# EasyEDA Pro project ERG-2025-2.eprj

# Schematic Schematic
Board Name: Balança-ERG; Create Date: 2025-11-15; Page Name: P1; Project Name: Amplificador_ERG-2025-2; Schematic Name: Schematic; Update Date: 2025-11-15; Company: EasyEDA.com; Page Size: A4; Version: V1.0
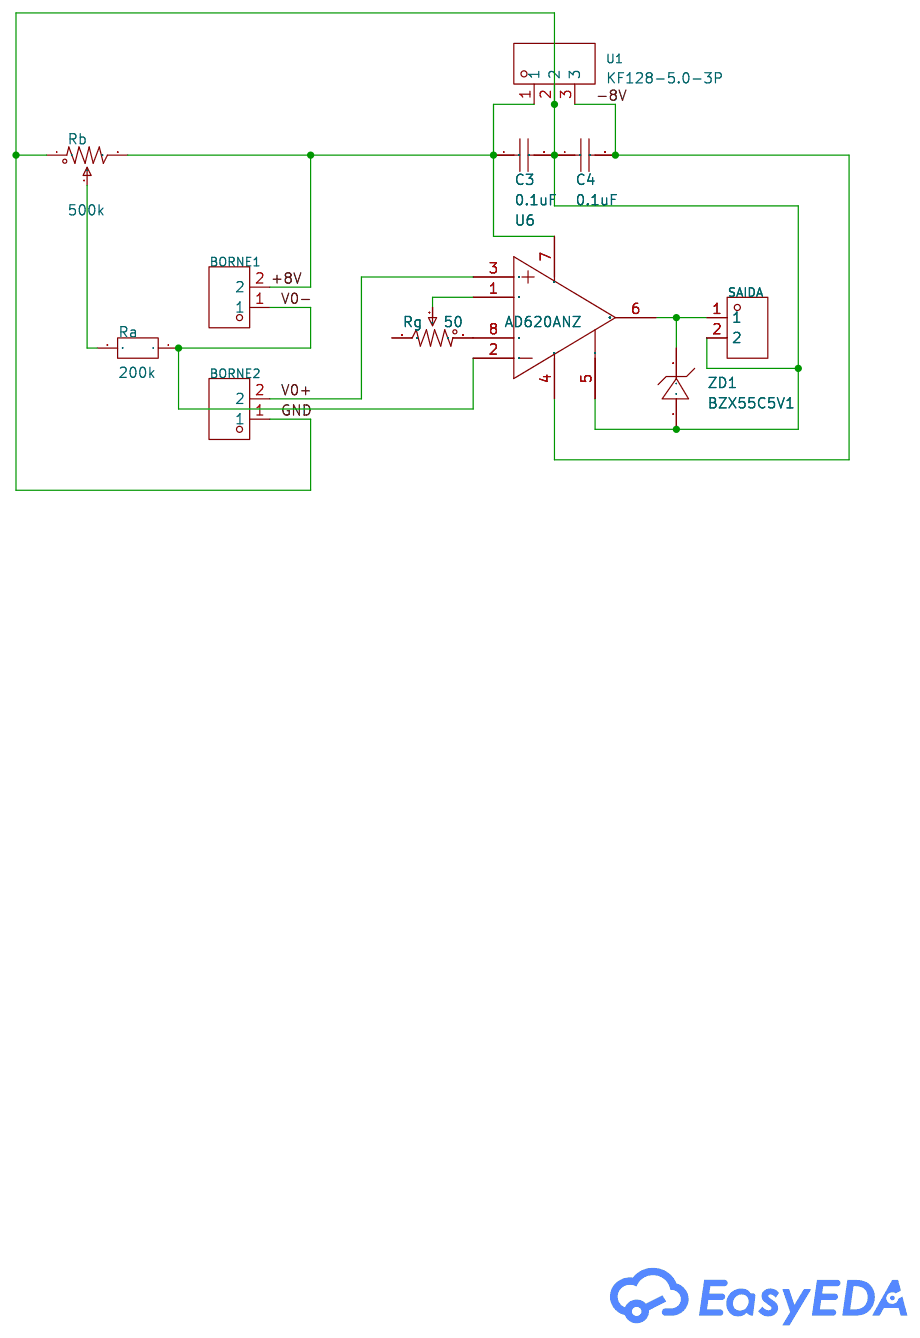
[diagram p0: schematic sheet]

## Parts
BORNE1  KF128L-5.08-2P  [CONN-TH_P5.08_KF128L-5.08-2P]
BORNE2  KF128L-5.08-2P  [CONN-TH_P5.08_KF128L-5.08-2P]
C3  0.1uF  [CAP-TH_L8.5-W5.0-P5.00-D1.2]
C4  0.1uF  [CAP-TH_L8.5-W5.0-P5.00-D1.2]
Ra  200k  [RES-TH_BD2.3-L6.5-P10.50-D0.5]
Rb  500k  [RES-ADJ-TH_3P-L10.0-W10.0-P2.50-L]
Rg  50  [RES-ADJ-TH_3P-L10.0-W10.0-P2.50-L]
SAIDA  KF128L-5.08-2P  [CONN-TH_P5.08_KF128L-5.08-2P]
U1  KF128-5.0-3P  [CONN-TH_3P-P5.00_KF128-5.0-3P]
U6  AD620ANZ  [DIP-8_L9.3-W6.4-P2.54-LS7.6-BL]
ZD1  BZX55C5V1  [DO-35_BD2.0-L4.0-P8.00-D0.5-FD]

## Library data of the parts
BORNE1 BORNE2 SAIDA = KF128L-5.08-2P: Structure:1x2P Pitch:5.08mm Color:Green Mounting Style:Straight Current Rating (Max):24A Voltage Rating (Max):250V Number of Pins:2P Number of Rows:1 Wire Gauge - AWG:12~22 Wire Gauge - AWG:12~22 Wire Gauge - mm2:2.5 Wire Gauge - mm2:2.5 Number of PINs Pe; LCSC Part Name: 5.08mm 1x2P 排数:1 每排P数:2 直插; Supplier Part: C474940; Manufacturer: KEFA(科发); Supplier Footprint: 插件,P=5.08mm; JLCPCB Part Class: Extended Part; Datasheet: https://atta.szlcsc.com/upload/public/pdf/source/20230317/B060EDB51EF5BF4A4FF6377D02780B11.pdf; Supplier: LCSC; Structure: 1x2P; Pitch: 5.08mm; Color: Green; Mounting Style: Straight; Current Rating (Max): 24A; Voltage Rating (Max): 250V; Number of Pins: 2P; Number of Rows: 1; Wire Gauge - AWG: 12~22; Wire Gauge - mm2: 2.5; Number of PINs Per Row: 2; Operating Temperature Range: -40℃~+105℃
C3 C4 = CT4-0805B105K500F3: Capacitance:1uF Tolerance:±10% Tolerance:±10% Voltage Rating:50V Temperature Coefficient:X7R; LCSC Part Name: 1uF ±10% 50V; Supplier Part: C94708; Manufacturer: FH(风华); Supplier Footprint: 插件,P=5.08mm; JLCPCB Part Class: Extended Part; Datasheet: https://atta.szlcsc.com/upload/public/pdf/source/20190402/C385200_059806A6312B28FF1421A2413EB641E1.pdf; Supplier: LCSC; Tolerance: ±10%; Voltage Rating: 50V; Temperature Coefficient: X7R
Ra = MF1/4W-1KΩ±1%T52: Type:Metal Film Resistors Resistance: Tolerance:±1% Tolerance:±1% Power(Watts):250mW Temperature Coefficient:±200ppm/℃ Temperature Coefficient:±200ppm/℃; LCSC Part Name: 金属膜电阻 1kΩ ±1% 250mW; Supplier Part: C713997; Manufacturer: 华星机电; Supplier Footprint: 插件,D2.3xL6.5mm; JLCPCB Part Class: Extended Part; Datasheet: https://atta.szlcsc.com/upload/public/pdf/source/20200731/C713882_AE8EB1102749D7E4FB4FB13DC898C429.pdf; Supplier: LCSC; Type: Metal Film Resistors; Tolerance: ±1%; Power(Watts): 250mW; Temperature Coefficient: ±200ppm/℃
Rb Rg = 3296W-1-103_C118954: Resistance: Tolerance:±10% Tolerance:±10%; LCSC Part Name: 10kΩ ±10%; Supplier Part: C118954; Manufacturer: BOCHEN(博晨); Manufacturer Part: 3296W-1-103; Supplier Footprint: 插件; JLCPCB Part Class: Extended Part; Datasheet: https://atta.szlcsc.com/upload/public/pdf/source/20171114/C118954_15106326646611117443.pdf; Supplier: LCSC; Tolerance: ±10%
U1 = KF128-5.0-3P: Structure:1x3P Pitch:5mm Color:Green Mounting Style:Straight Current Rating (Max):24A Voltage Rating (Max):250V Number of Pins:3P Number of Rows:1 Wire Gauge - AWG:12~22 Wire Gauge - AWG:12~22 Wire Gauge - mm2:2.5 Wire Gauge - mm2:2.5 Number of PINs Per R; LCSC Part Name: 5mm 1x3P 排数:1 每排P数:3 直插; Supplier Part: C474951; Manufacturer: KEFA(科发); Supplier Footprint: 插件,P=5mm; JLCPCB Part Class: Extended Part; Datasheet: https://atta.szlcsc.com/upload/public/pdf/source/20230317/B8CD42C0E3A38C01CD877E6842427715.pdf; Supplier: LCSC; Structure: 1x3P; Pitch: 5mm; Color: Green; Mounting Style: Straight; Current Rating (Max): 24A; Voltage Rating (Max): 250V; Number of Pins: 3P; Number of Rows: 1; Wire Gauge - AWG: 12~22; Wire Gauge - mm2: 2.5; Number of PINs Per Row: 3; Operating Temperature Range: -40℃~+105℃
U6 = AD620ANZ: Number of Channels:Single channel Common Mode Rejection Ratio(CMRR):100dB Ib - Input Bias Current:500pA Vos - Input Offset Voltage:30uV Gain Bandwidth Product:- Slew Rate:0.75V/us Voltage - Supply:2.3V~18V；-18V~-2.3V Voltage - Supply:2.3V~18V；-18V~-2.3V O; LCSC Part Name: 低成本低功耗仪表放大器; Supplier Part: C9680; Manufacturer: ADI(亚德诺); Supplier Footprint: DIP-8; JLCPCB Part Class: Extended Part; Datasheet: https://atta.szlcsc.com/upload/public/pdf/source/20121103/1457706545320.pdf; Supplier: LCSC; Number of Channels: Single channel; Common Mode Rejection Ratio(CMRR): 100dB; Ib - Input Bias Current: 500pA; Vos - Input Offset Voltage: 30uV; Slew Rate: 0.75V/us; Voltage - Supply: 2.3V~18V；-18V~-2.3V; Output Current: 18mA; -3dB Bandwidth: 120kHz; Quiescent Current per Amplifier: 1.3mA; Input Offset Voltage Drift(Vos TC): 0.3uV/℃; Operating Temperature: -40℃~+85℃
ZD1 = BZX55C5V1_C2512: Diode Configuration:Independent Type Zener Voltage(Nom):5.1V Reverse Leakage Current (Ir):100nA@1V Zener Voltage(Range):4.8V~5.4V Zener Voltage(Range):4.8V~5.4V Pd - Power Dissipation:- Impedance(Zzt):35Ω; Supplier Part: C2512; Manufacturer: ST(先科); Supplier Footprint: DO-35; JLCPCB Part Class: Extended Part; Datasheet: https://atta.szlcsc.com/upload/public/pdf/source/20170719/C118630_1500457760295828336.pdf; Supplier: LCSC; Diode Configuration: Independent Type; Zener Voltage(Nom): 5.1V; Reverse Leakage Current (Ir): 100nA@1V; Zener Voltage(Range): 4.8V~5.4V; Impedance(Zzt): 35Ω

## Nets
+8V: BORNE1.2 C3.1 Rb.3 U1.1 U6.7(+VS)
-8V: C4.2 U1.3 U6.4(-VS)
GND: BORNE2.1 C3.2 C4.1 Rb.1 SAIDA.2 U1.2 U6.5(REF) ZD1.1(A)
V0+: BORNE2.2 U6.3(+IN)
V0-: BORNE1.1 Ra.1 U6.2(-IN)
$1N521: Rg.1 U6.8(RG)
$1N525: Rg.2 U6.1(RG)
$1N810: SAIDA.1 U6.6(OUTPUT) ZD1.2(K)
$1N1172: Ra.2 Rb.2

Not connected (* = marked no-connect by the designer): Rg 3

# Board PCB
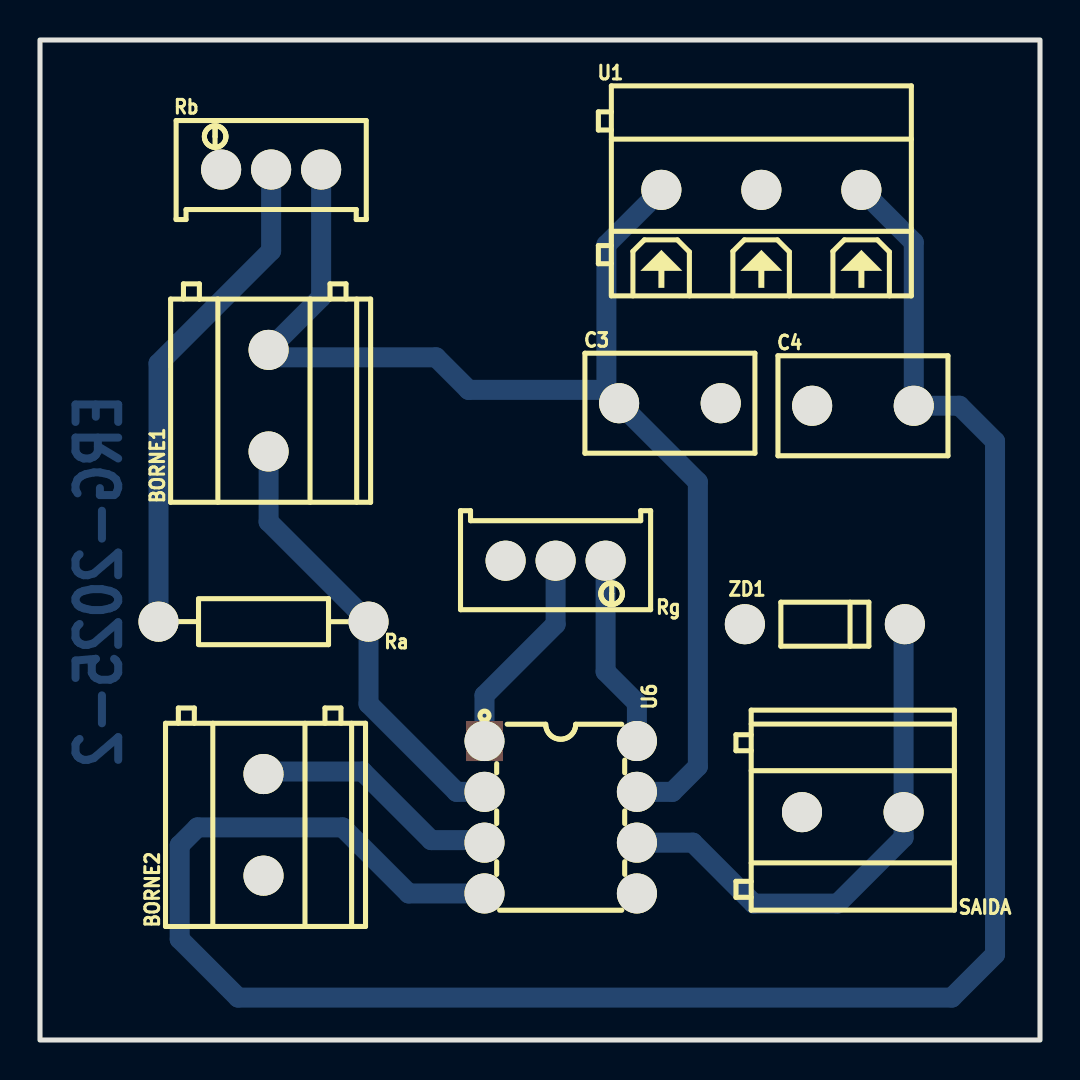
[diagram p1: board, top side]
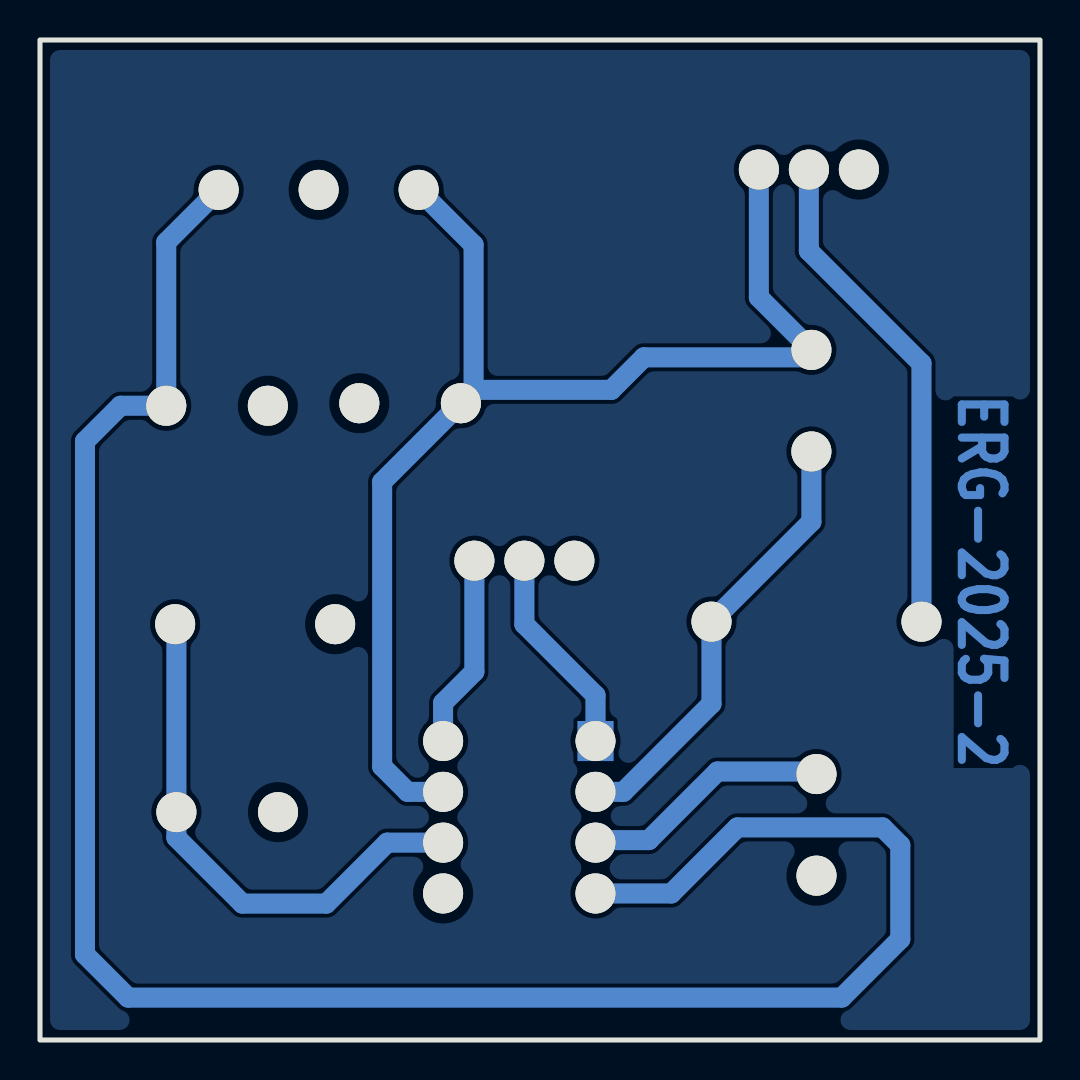
[diagram p2: board, bottom side, seen from below]

Outline 50 x 50 mm; copper layers: Top Layer, Bottom Layer. Coordinates in mm from the lower left corner of the outline.
Outline path: rectangle 0,50 50,0
Stack: Top Layer 0.035mm / Dielectric1 1.51mm FR4 er 4.5 / Bottom Layer 0.035mm

## Design rules (mm)
template: Custom Config
spacing copperThickness1oz (default): track to track 0.102, other pairs 0.152 to 0.3
spacing copperThickness2oz: track to track 0.203, other pairs 0.152 to 0.3
track width copperThickness1oz (default): min 1, default 1, max 1
track width copperThickness2oz: min 0.203, default 0.254, max 2.54
differential pair differentialPair (default): width min 0.127, default 0.254, max 2.54; gap min 0.152, default 0.152
via viaSize (default): diameter min 0.5, default 0.61, max 10; hole min 0.3, default 0.305, max 6.3

## Placement (name value [footprint] x y rotation side)
BORNE1  KF128L-5.08-2P  [CONN-TH_P5.08_KF128L-5.08-2P]  11.43 31.97 90 top
BORNE2  KF128L-5.08-2P  [CONN-TH_P5.08_KF128L-5.08-2P]  11.18 10.76 90 top
C3  0.1uF  [CAP-TH_L8.5-W5.0-P5.00-D1.2]  31.5 31.84 0 top
C4  0.1uF  [CAP-TH_L8.5-W5.0-P5.00-D1.2]  41.15 31.71 0 top
Ra  200k  [RES-TH_BD2.3-L6.5-P10.50-D0.5]  11.18 20.92 180 top
Rb  500k  [RES-ADJ-TH_3P-L10.0-W10.0-P2.50-L]  11.56 43.52 0 top
Rg  50  [RES-ADJ-TH_3P-L10.0-W10.0-P2.50-L]  25.78 23.97 180 top
SAIDA  KF128L-5.08-2P  [CONN-TH_P5.08_KF128L-5.08-2P]  40.64 11.39 180 top
U1  KF128-5.0-3P  [CONN-TH_3P-P5.00_KF128-5.0-3P]  36.07 42.51 0 top
U6  AD620ANZ  [DIP-8_L9.3-W6.4-P2.54-LS7.6-BL]  26.03 11.14 270 top
ZD1  BZX55C5V1  [DO-35_BD2.0-L4.0-P8.00-D0.5-FD]  39.24 20.79 0 top

## Footprints (pads in the part's own frame, mm; a bottom-side part is the same pattern mirrored in y, then rotated)
CAP-TH_L8.5-W5.0-P5.00-D1.2
  round 2 hole 2x0.5: 1(-2.54,0) 2(2.54,0)
CONN-TH_3P-P5.00_KF128-5.0-3P
  round 2 hole 2x0.5: 1(-5,0) 2(0,0) 3(5,0)
CONN-TH_P5.08_KF128L-5.08-2P
  round 2 hole 2x0.5: 1(-2.54,0) 2(2.54,0)
DIP-8_L9.3-W6.4-P2.54-LS7.6-BL
  rect 2x1.8 hole 2x0.5: 1(-3.81,-3.81)
  round 2 hole 2x0.5: 2(-1.27,-3.81) 3(1.27,-3.81) 4(3.81,-3.81) 5(3.81,3.81) 6(1.27,3.81) 7(-1.27,3.81) 8(-3.81,3.81)
DO-35_BD2.0-L4.0-P8.00-D0.5-FD
  round 2 hole 2x0.5: 1(-4,0) 2(4,0)
RES-ADJ-TH_3P-L10.0-W10.0-P2.50-L
  round 2 hole 2x0.5: 1(-2.5,0) 2(0,0) 3(2.5,0)
RES-TH_BD2.3-L6.5-P10.50-D0.5
  round 2 hole 2x0.5: 1(-5.25,0) 2(5.25,0)

## Nets
As in the schematic.

Pads without a net: Rg 3

## Routing (per net, layer and track width the routed paths; a pad name or vN(x,y) marks a point on that pad's centre or on a via; arc(x,y) is an arc through that point)
+8V: length 63.8
  Bottom Layer w1: 28.19,32.6 28.1,32.51 21.43,32.51 19.8,34.13 11.33,34.13 11.19,34.27 14.06,37.13 Rb.3 ; 28.19,32.6 28.32,32.6 28.32,39.76 U1.1 ; 28.19,32.6 C3.1 32.89,27.9 32.89,13.68 31.62,12.41 U6.7
-8V: length 106.9
  Bottom Layer w1: U1.3 43.69,39.89 C4.2 45.97,31.71 47.75,29.93 47.75,4.28 45.59,2.12 9.91,2.12 6.98,5.04 6.98,9.74 7.87,10.63 15.13,10.63 18.43,7.33 U6.4
V0+: length 12.6
  Bottom Layer w1: 11.18,13.3 11.3,13.42 16.13,13.42 19.56,10 22.1,10 U6.3
V0-: length 22.3
  Bottom Layer w1: U6.2 20.83,12.41 16.43,16.81 Ra.1 11.43,25.91 BORNE1.1
$1N521: length 9.7
  Bottom Layer w1: Rg.1 28.28,18.42 29.84,16.85 U6.8
$1N525: length 10.5
  Bottom Layer w1: U6.1 22.22,17.23 25.78,20.79 Rg.2
$1N810: length 26.9
  Bottom Layer w1: U6.6 32.64,9.87 35.69,6.82 39.88,6.82 43.18,10.12 SAIDA.1 43.18,20.78 43.19,20.79 43.5,20.79
$1N1172: length 24.9
  Bottom Layer w1: Ra.2 5.93,33.83 11.56,39.46 Rb.2

## Copper pours and planes (outline as drawn; the poured copper is in the pictures)
GND on Bottom Layer: 0,50 50,50 50,0 0,0

## Text on the board
Bottom Layer: ERG-2025-2
